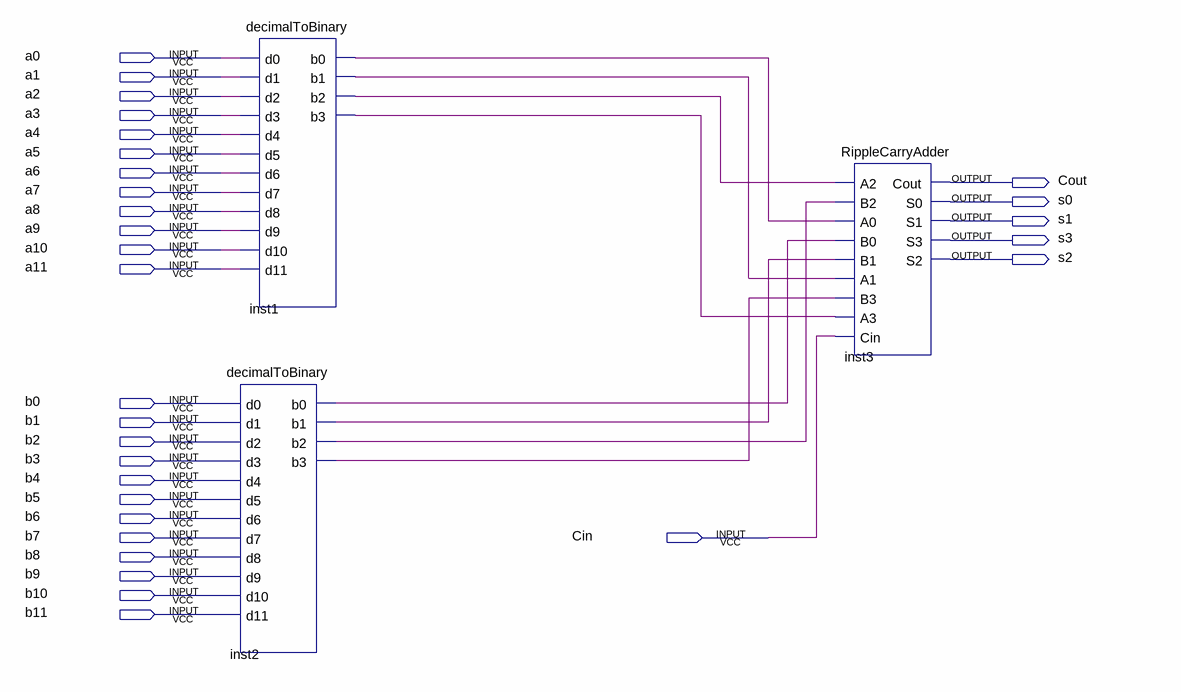
[diagram p0: schematic sheet]
// Quartus schematic newAdder.bdf as structural Verilog: 3 symbols, 30 pins
module newAdder (
  input  a0,
  input  a1,
  input  a2,
  input  a3,
  input  a4,
  input  a5,
  input  a6,
  input  a7,
  input  a8,
  input  a9,
  input  a10,
  input  a11,
  input  b0,
  input  b1,
  input  b2,
  input  b3,
  input  b4,
  input  b5,
  input  b6,
  input  b7,
  input  Cin,
  input  b8,
  input  b9,
  input  b10,
  input  b11,
  output Cout,
  output s0,
  output s1,
  output s3,
  output s2
);

  wire inst1_b0, inst1_b1, inst1_b2, inst1_b3, inst2_b0, inst2_b1, inst2_b2, inst2_b3;

  decimalToBinary inst2 (
    .d0(b0), .d1(b1), .d2(b2), .d3(b3), .d4(b4), .d5(b5), .d6(b6), .d7(b7), .d8(b8), .d9(b9), .d10(b10),
    .d11(b11), .b0(inst2_b0), .b1(inst2_b1), .b2(inst2_b2), .b3(inst2_b3));
  decimalToBinary inst1 (
    .d0(a0), .d1(a1), .d2(a2), .d3(a3), .d4(a4), .d5(a5), .d6(a6), .d7(a7), .d8(a8), .d9(a9), .d10(a10),
    .d11(a11), .b0(inst1_b0), .b1(inst1_b1), .b2(inst1_b2), .b3(inst1_b3));
  RippleCarryAdder inst3 (
    .A2(inst1_b2), .B2(inst2_b2), .A0(inst1_b0), .B0(inst2_b0), .B1(inst2_b1), .A1(inst1_b1), .B3(inst2_b3),
    .A3(inst1_b3), .Cin(Cin), .Cout(Cout), .S0(s0), .S1(s1), .S3(s3), .S2(s2));
endmodule
